# Altium schematic sheet AHD USB Section.SchDoc: USB Section
size A; DrawnBy: Adam Vadala-Roth; DocumentNumber: 6; Revision: 2.4b; SheetNumber: 6; SheetTotal: 9
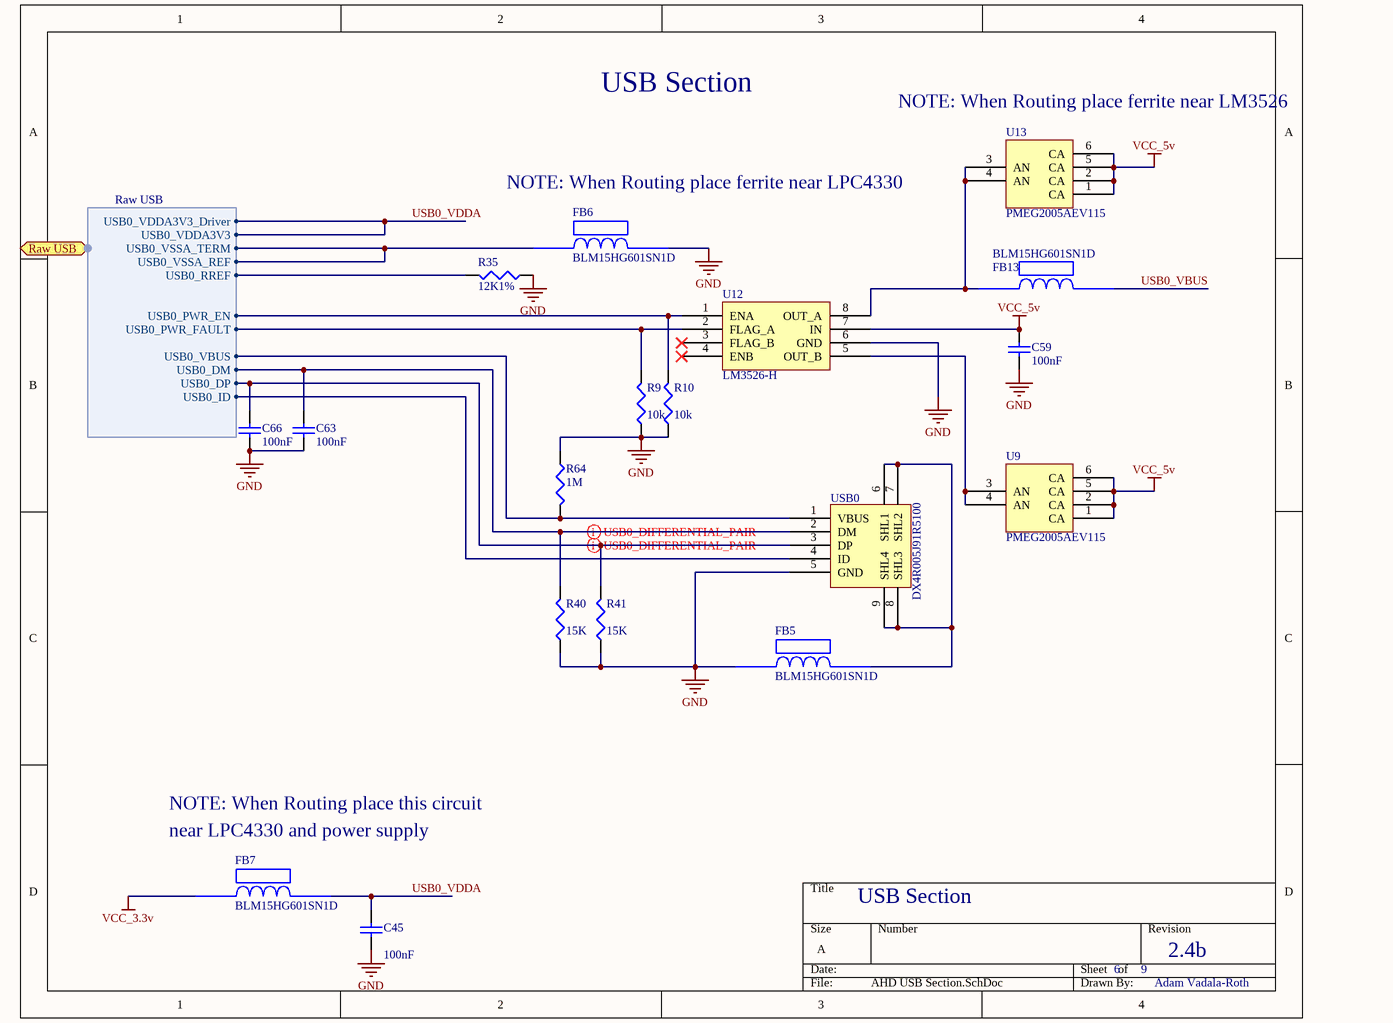
[diagram p0: AHD USB Section.SchDoc]

## Parts
C45  C1: 100nF  [CAPC1608L]  (hidden comment: Cap Semi)
C59  C1: 100nF  [CAPC1608L]  (hidden comment: Cap Semi)
C63  C1: 100nF  [CAPC1608L]  (hidden comment: Cap Semi)
C66  C1: 100nF  [CAPC1608L]  (hidden comment: Cap Semi)
FB5  BLM15HG601SN1D  [BLM18PG121SN1D]
FB6  BLM15HG601SN1D  [BLM18PG121SN1D]
FB7  BLM15HG601SN1D  [BLM18PG121SN1D]
FB13  BLM15HG601SN1D  [BLM18PG121SN1D]
R9  value 10k  [J1-0603]  (hidden comment: Res3)
R10  value 10k  [J1-0603]  (hidden comment: Res3)
R35  value 12K1%  [RESC1608L]  (hidden comment: Res3)
R40  value 15K  [J1-0603]  (hidden comment: Res3)
R41  value 15K  [J1-0603]  (hidden comment: Res3)
R64  value 1M  [J1-0603]  (hidden comment: Res3)
U9  PMEG2005AEV115  [PMEG2005AEV115]
U12  LM3526-H  [LM3526]
U13  PMEG2005AEV115  [PMEG2005AEV115]
USB0  DX4R005J91R5100  [Micro USB Circular Holes Only]

## Ports
Raw USB (harness Raw USB)

## Harnesses
Raw USB: USB0_VDDA3V3_Driver, USB0_VDDA3V3, USB0_VSSA_TERM, USB0_VSSA_REF, USB0_VBUS, USB0_DP, USB0_DM, USB0_ID, USB0_RREF, USB0_PWR_EN, USB0_PWR_FAULT

## Nets
GND: C45.2 C59.2 C63.2 C66.2 FB5.1 FB6.2 R9.1 R10.1 R35.1 R40.1 R41.1 R64.1 U12.6(GND) USB0.5(GND)
VCC_3.3v: FB7.1
VCC_5v: C59.1 U9.1(CA) U9.2(CA) U9.5(CA) U9.6(CA) U12.7(IN) U13.1(CA) U13.2(CA) U13.5(CA) U13.6(CA)
USB0_VBUS: FB13.2
USB0_VDDA: C45.1 FB7.2 ; port Raw USB.USB0_VDDA3V3_Driver, port Raw USB.USB0_VDDA3V3
NetC63_1: C63.1 R40.2 USB0.2(DM) ; port Raw USB.USB0_DM
NetC66_1: C66.1 R41.2 USB0.3(DP) ; port Raw USB.USB0_DP
NetFB5_2: FB5.2 USB0.6(SHL1) USB0.7(SHL2) USB0.8(SHL3) USB0.9(SHL4)
NetFB6_1: FB6.1 ; port Raw USB.USB0_VSSA_TERM, port Raw USB.USB0_VSSA_REF
NetFB13_1: FB13.1 U12.8(OUT_A) U13.3(AN) U13.4(AN)
NetR9_2: R9.2 U12.2(FLAG_A) ; port Raw USB.USB0_PWR_FAULT
NetR10_2: R10.2 U12.1(ENA) ; port Raw USB.USB0_PWR_EN
NetR35_2: R35.2 ; port Raw USB.USB0_RREF
NetR64_2: R64.2 USB0.1(VBUS) ; port Raw USB.USB0_VBUS
NetU9_3: U9.3(AN) U9.4(AN) U12.5(OUT_B)
NetUSB0_4: USB0.4(ID) ; port Raw USB.USB0_ID

Not connected (* = marked no-connect by the designer): U12 3(FLAG_B)* 4(ENB)*

## Layout directives
differential pair: NetC63_1, NetC66_1

## Notes on the sheet
- USB Section
- (near U13) NOTE: When Routing place ferrite near LM3526
- NOTE: When Routing place ferrite near LPC4330
- NOTE: When Routing place this circuit
- near LPC4330 and power supply

## Library data of the parts
C45 C59 C63 C66 = Cap Semi: Capacitor (Semiconductor SIM Model); Published: 8-Jun-2000; LatestRevisionDate: 29-May-2009; LatestRevisionNote: IPC-7351 Footprint Added.; PackageReference: C1206; Publisher: Altium Limited; PackageDescription: Chip Capacitor
R9 R10 R35 R40 R41 R64 = Res3: Resistor; Published: 8-Jun-2000; LatestRevisionDate: 29-May-2009; LatestRevisionNote: IPC-7351 Footprint Added.; PackageReference: J1-0603; Publisher: Altium Limited; PackageDescription: Chip Resistor
U12 = LM3526
USB0 = Micro USB: Micro USB Jack B